# Altium schematic sheet Power.SchDoc
size A4; SheetNumber: 3; SheetTotal: 3
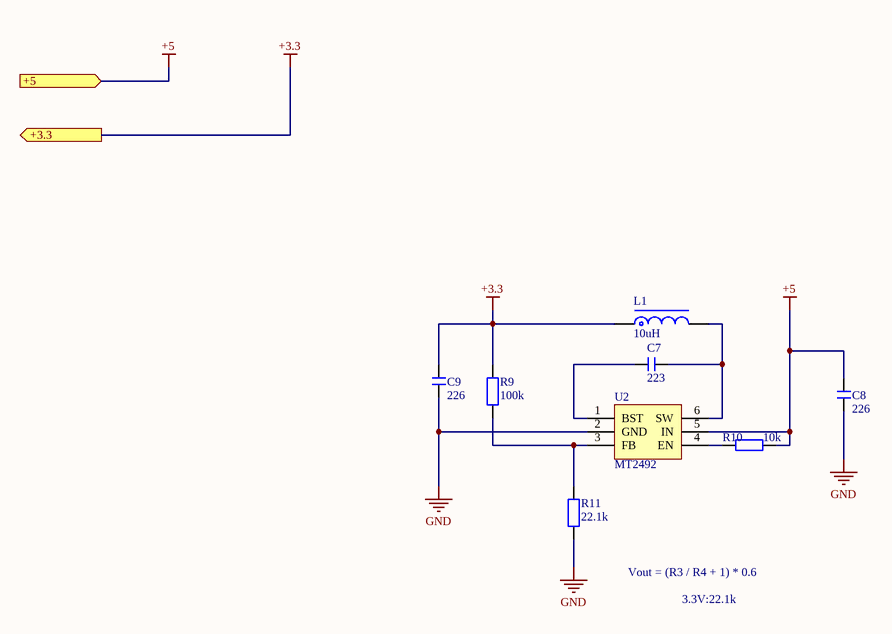
[diagram p0: Power.SchDoc]

## Parts
C7  223  [C 0603-L]
C8  226  [C 0805-L]
C9  226  [C 0805-L]
L1  10uH  [L 1206]
R9  100k  [R 0603_L]
R10  10k  [R 0603_L]
R11  22.1k  [R 0603_L]
U2  MT2492  [SOT23-6N]

## Ports
+3.3 (out), +5 (in)

## Nets
+3.3: C9.1 L1.1 R9.1 ; port +3.3
+5: C8.1 R10.2 U2.5(IN) ; port +5
GND: C8.2 C9.2 R11.1 U2.2(GND)
NetC7_1: C7.1 L1.2 U2.6(SW)
NetC7_2: C7.2 U2.1(BST)
NetR9_2: R9.2 R11.2 U2.3(FB)
NetR10_1: R10.1 U2.4(EN)

## Notes on the sheet
- Vout = (R3 / R4 + 1) * 0.6
- 3.3V:22.1k

## Library data of the parts
C7-C9 = C: 贴片电容; BOM名称: 无极性贴片电容; 优秀评价可免费更新: 联系淘宝ID：黄晶宝石，获取更新版封装库; 本封装库来自淘宝卖家 ID：黄晶宝石: 其他店铺购入均为盗版，请立即申请退款; 联系卖家，免费查找封装: 唯一出售店铺网址https://shop463601444.taobao.com
L1 = L-NR: NR磁胶电感; 优秀评价可免费更新: 联系淘宝ID：黄晶宝石，获取更新版封装库; 本封装库来自淘宝卖家 ID：黄晶宝石: 其他店铺购入均为盗版，请立即申请退款; 联系卖家，免费查找封装: 唯一出售店铺网址https://shop463601444.taobao.com; BOM名称: NR磁胶电感
R9-R11 = R: 贴片电阻; 优秀评价可免费更新: 联系淘宝ID：黄晶宝石，获取更新版封装库; 本封装库来自淘宝卖家 ID：黄晶宝石: 其他店铺购入均为盗版，请立即申请退款; 联系卖家，免费查找封装: 唯一出售店铺网址https://shop463601444.taobao.com; BOM名称: 贴片电阻
U2 = MP2359: DC降压芯片; 卖家免费技术支持，联系售后: 唯一出售店铺网址https://shop463601444.taobao.com; 封装库来自淘宝卖家 ID：黄晶宝石: 其他店铺购入均为假冒，请立即申请退款，本店奖励2~5元现金; BOM名称: DC降压芯片; 卖家免费查找封装，联系售后: 唯一出售店铺网址https://shop463601444.taobao.com